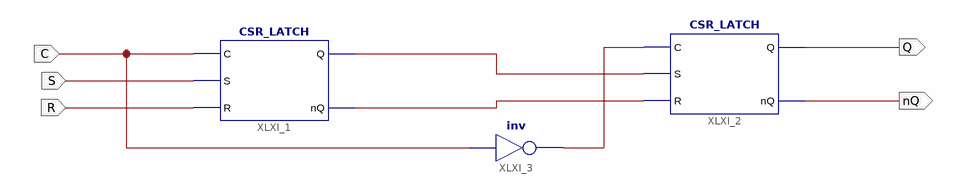
[diagram p0: schematic sheet 1]
// Xilinx ISE schematic MS_FLIPFLOP.sch (kintex7) as structural Verilog: 3 symbols, 5 ports
module MS_FLIPFLOP (
  input  C,
  input  S,
  input  R,
  output Q,
  output nQ
);

  wire XLXN_3, XLXN_4, XLXN_5;

  CSR_LATCH XLXI_1 (.C(C), .S(S), .R(R), .Q(XLXN_4), .nQ(XLXN_5));
  CSR_LATCH XLXI_2 (.C(XLXN_3), .S(XLXN_4), .R(XLXN_5), .Q(Q), .nQ(nQ));
  not XLXI_3 (XLXN_3, C);
endmodule
